# Altium schematic sheet STMKernel.SchDoc
size A3
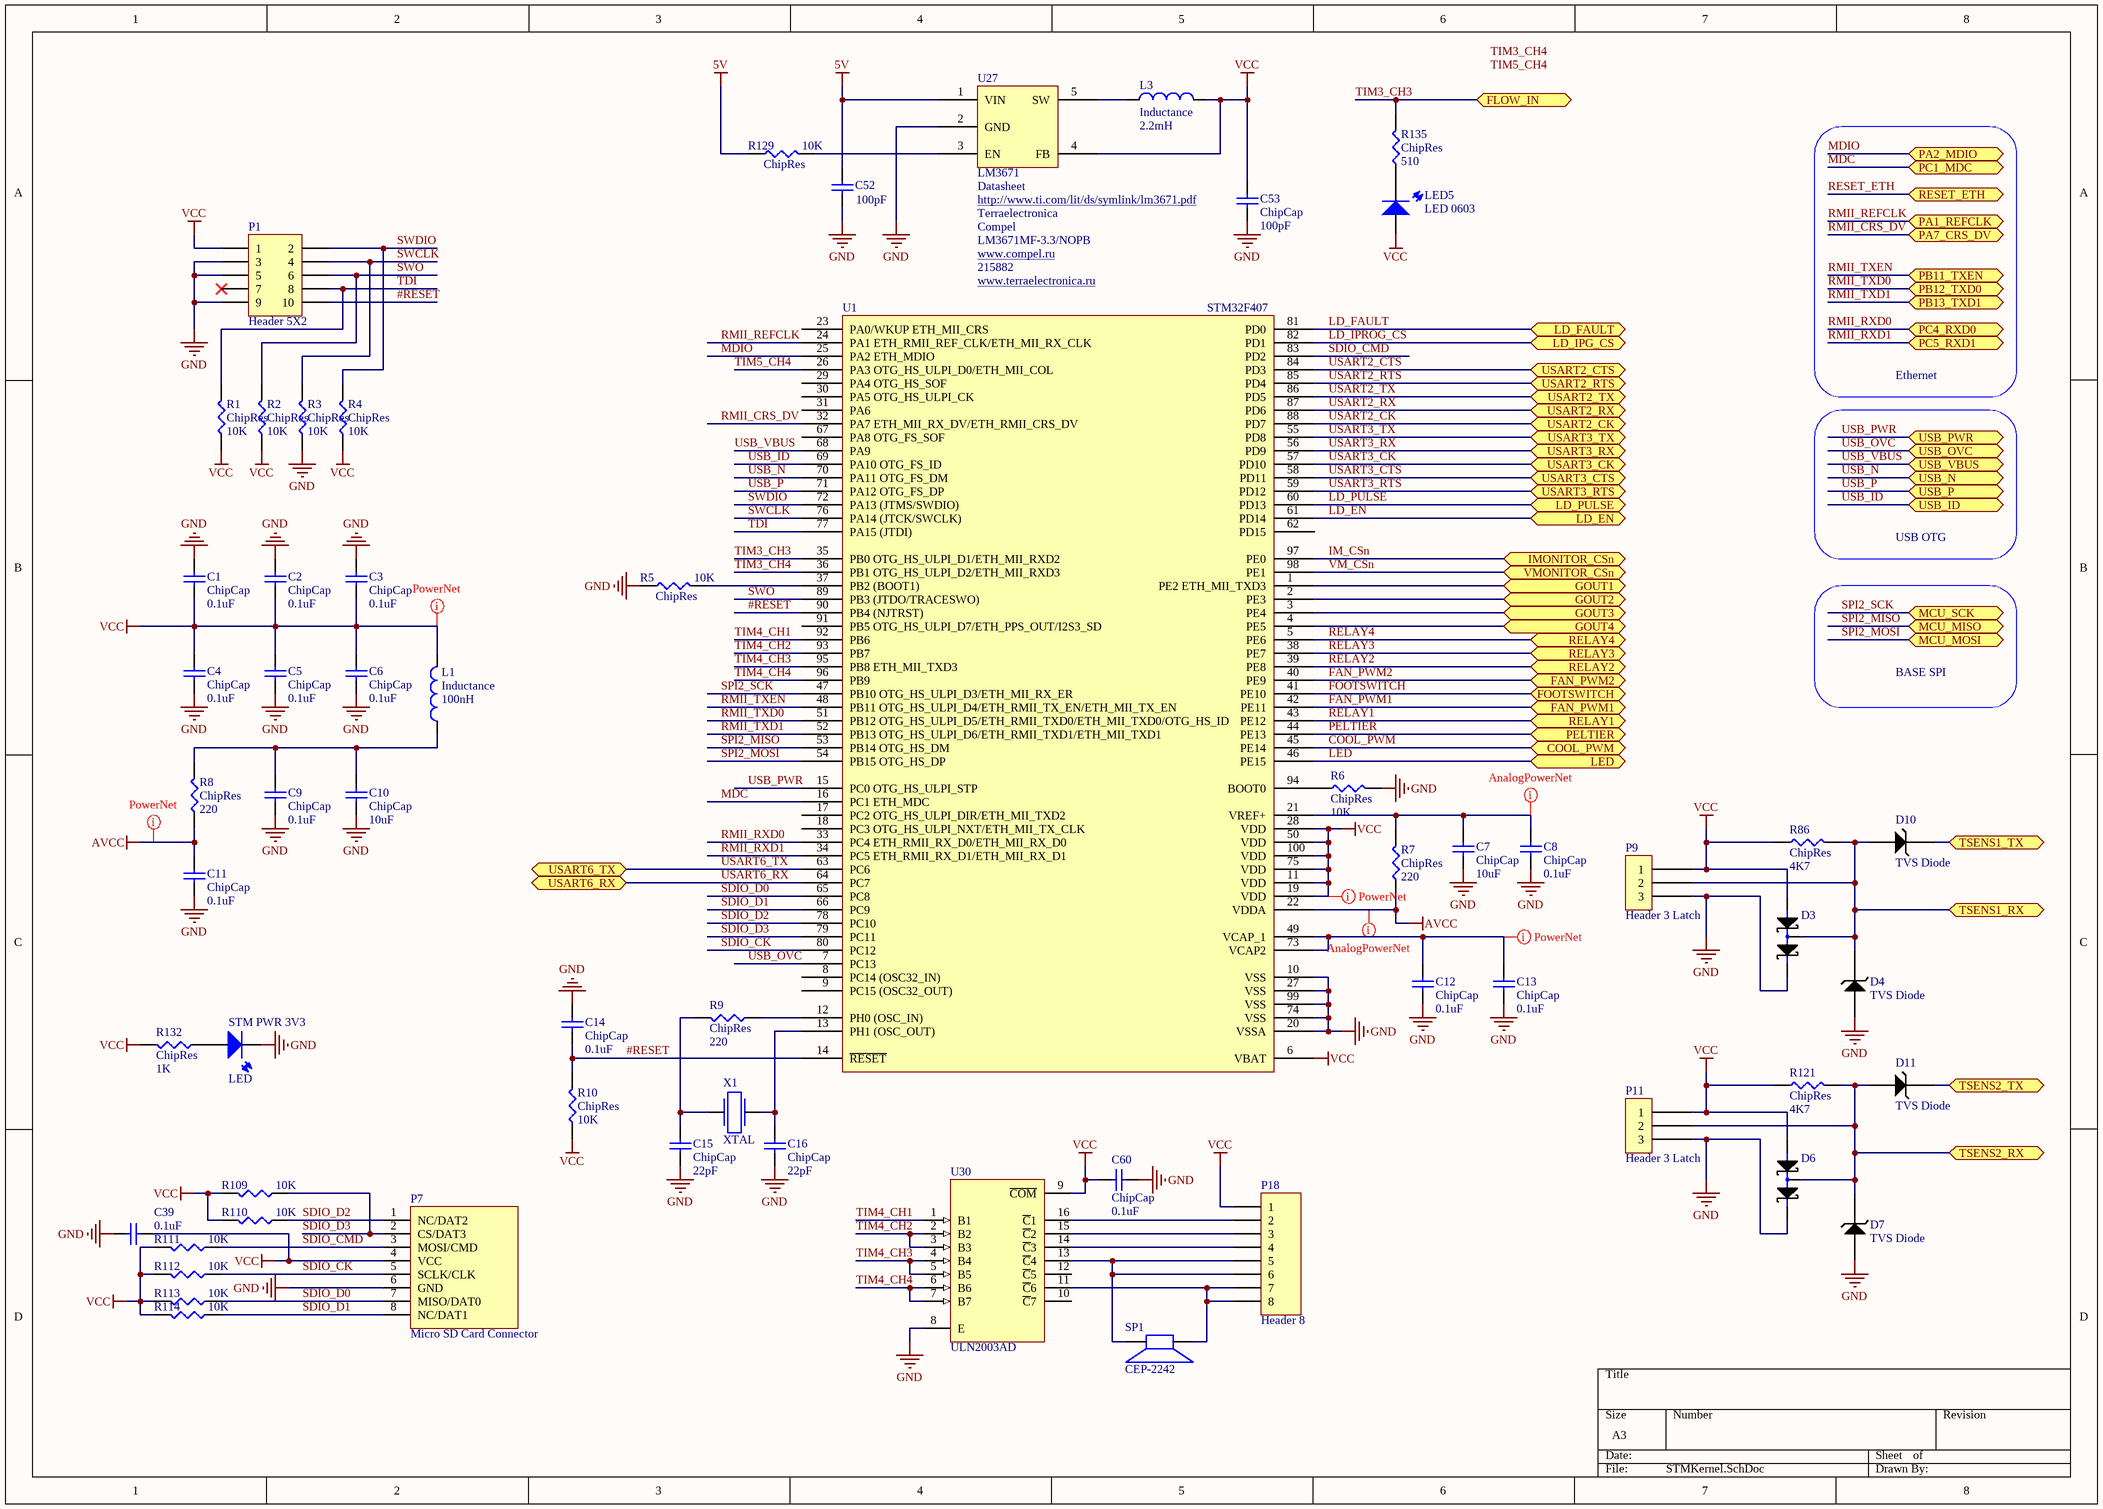
[diagram p0: STMKernel.SchDoc]

## Parts
C1  ChipCap  value 0.1uF  [CAP0805]
C2  ChipCap  value 0.1uF  [CAP0805]
C3  ChipCap  value 0.1uF  [CAP0805]
C4  ChipCap  value 0.1uF  [CAP0805]
C5  ChipCap  value 0.1uF  [CAP0805]
C6  ChipCap  value 0.1uF  [CAP0805]
C7  ChipCap  value 10uF  [CAP0805]
C8  ChipCap  value 0.1uF  [CAP0805]
C9  ChipCap  value 0.1uF  [CAP0805]
C10  ChipCap  value 10uF  [CAP0805]
C11  ChipCap  value 0.1uF  [CAP0805]
C12  ChipCap  value 0.1uF  [CAP0805]
C13  ChipCap  value 0.1uF  [CAP0805]
C14  ChipCap  value 0.1uF  [CAP0805]
C15  ChipCap  value 22pF  [CAP0805]
C16  ChipCap  value 22pF  [CAP0805]
C39  value 0.1uF  [CAP0805]  (hidden comment: ChipCap)
C52  value 100pF  [CAP1210]  (hidden comment: ChipCap)
C53  ChipCap  value 100pF  [CAP1210]
C60  ChipCap  value 0.1uF  [CAP0805]
D3  Diode Schottky  [SOT23]  (value not drawn)
D4  TVS Diode  [DO-214AS]
D6  Diode Schottky  [SOT23]  (value not drawn)
D7  TVS Diode  [DO-214AS]
D10  TVS Diode  [DO-214AS]
D11  TVS Diode  [DO-214AS]
L1  Inductance  value 100nH  [CM32]
L3  Inductance  value 2.2mH  [CDRH2D14]
LED5  LED 0603  [LED 0603]
P1  Header 5X2  [HDR2X5]
P7  Micro SD Card Connector  [WR-CRD SD Micro]
P9  Header 3 Latch  [Header 3 latch]
P11  Header 3 Latch  [Header 3 latch]
P18  Header 8  [HDR1X8]
R1  ChipRes  value 10K  [RES0805]
R2  ChipRes  value 10K  [RES0805]
R3  ChipRes  value 10K  [RES0805]
R4  ChipRes  value 10K  [RES0805]
R5  ChipRes  value 10K  [RES0805]
R6  ChipRes  value 10K  [RES0805]
R7  ChipRes  value 220  [RES0805]
R8  ChipRes  value 220  [RES0805]
R9  ChipRes  value 220  [RES0805]
R10  ChipRes  value 10K  [RES0805]
R86  ChipRes  value 4K7  [RES0805]
R109  value 10K  [RES0805]  (hidden comment: ChipRes)
R110  value 10K  [RES0805]  (hidden comment: ChipRes)
R111  value 10K  [RES0805]  (hidden comment: ChipRes)
R112  value 10K  [RES0805]  (hidden comment: ChipRes)
R113  value 10K  [RES0805]  (hidden comment: ChipRes)
R114  value 10K  [RES0805]  (hidden comment: ChipRes)
R121  ChipRes  value 4K7  [RES0805]
R129  ChipRes  value 10K  [RES0805]
R132  ChipRes  value 1K  [RES0805]
R135  ChipRes  value 510  [RES0805]
SP1  CEP-2242  [Buzzer]
STM_PWR_3V3  LED  [PLCC-2]
U1  STM32F407  [LQFP100]
U27  LM3671  ComponentLink1Description: Datasheet  Supplier 1: Terraelectronica  Supplier 2: Compel  Supplier Part Number 2: LM3671MF-3.3/NOPB  Supplier Part Number 1: 215882  [SOT23-5]
U30  ULN2003AD  [D016_N]
X1  XTAL  [BCY-W2/E4.7]

## Ports
COOL_PWM, FAN_PWM1, FAN_PWM2, FLOW_IN, FOOTSWITCH, GOUT1, GOUT2, GOUT3, GOUT4, IMONITOR_CSn, LD_EN, LD_FAULT, LD_IPG_CS, LD_PULSE, LED, MCU_MISO, MCU_MOSI, MCU_SCK, PA1_REFCLK, PA2_MDIO, PA7_CRS_DV, PB11_TXEN, PB12_TXD0, PB13_TXD1, PC1_MDC, PC4_RXD0, PC5_RXD1, PELTIER, RELAY1, RELAY2, RELAY3, RELAY4, RESET_ETH, TSENS1_RX, TSENS1_TX, TSENS2_RX, TSENS2_TX, USART2_CK, USART2_CTS, USART2_RTS, USART2_RX, USART2_TX, USART3_CK, USART3_CTS, USART3_RTS, USART3_RX, USART3_TX, USART6_RX, USART6_TX, USB_ID, USB_N, USB_OVC, USB_P, USB_PWR, USB_VBUS, VMONITOR_CSn

## Nets
5V: C52.2 R129.1 U27.1(VIN)
AVCC: C11.2 R7.1 R8.1 U1.22(VDDA)
GND: C1.2 C2.2 C3.2 C4.1 C5.1 C6.1 C7.1 C8.1 C9.1 C10.1 C11.1 C12.1 C13.1 C14.2 C15.1 C16.1 C39.2 C52.1 C53.1 C60.1 D3.2 D4.2 D6.2 D7.2 P1.3 P1.5 P1.9 P7.6(GND) P9.3 P11.3 R3.1 R5.1 R6.2 STM_PWR_3V3.1 U1.10(VSS) U1.20(VSSA) U1.27(VSS) U1.74(VSS) U1.99(VSS) U27.2(GND) U30.8(E)
VCC: C1.1 C2.1 C3.1 C4.2 C5.2 C6.2 C39.1 C53.2 C60.2 D3.1 D6.1 L1.1 L3.1 LED5.2 P1.1 P7.4(VCC) P9.1 P11.1 P18.1 R1.1 R2.1 R4.1 R10.1 R86.2 R109.2 R110.2 R111.2 R112.2 R113.2 R114.2 R121.2 R132.2 U1.6(VBAT) U1.11(VDD) U1.19(VDD) U1.28(VDD) U1.50(VDD) U1.75(VDD) U1.100(VDD) U27.4(FB) U30.9(~{COM})
#RESET: C14.1 P1.10 R10.2 U1.14(~{RESET}) U1.90(PB4_(NJTRST))
COOL_PWM: U1.45(PE14) ; port COOL_PWM
FAN_PWM1: U1.42(PE11) ; port FAN_PWM1
FAN_PWM2: U1.40(PE9) ; port FAN_PWM2
FOOTSWITCH: U1.41(PE10) ; port FOOTSWITCH
GOUT1: U1.1(PE2_ETH_MII_TXD3) ; port GOUT1
GOUT2: U1.2(PE3) ; port GOUT2
GOUT3: U1.3(PE4) ; port GOUT3
GOUT4: U1.4(PE5) ; port GOUT4
IM_CSn: U1.97(PE0) ; port IMONITOR_CSn
LD_EN: U1.61(PD14) ; port LD_EN
LD_FAULT: U1.81(PD0) ; port LD_FAULT
LD_IPROG_CS: U1.82(PD1) ; port LD_IPG_CS
LD_PULSE: U1.60(PD13) ; port LD_PULSE
LED: U1.46(PE15) ; port LED
MDC: U1.16(PC1_ETH_MDC) ; port PC1_MDC
MDIO: U1.25(PA2_ETH_MDIO) ; port PA2_MDIO
PELTIER: U1.44(PE13) ; port PELTIER
RELAY1: U1.43(PE12) ; port RELAY1
RELAY2: U1.39(PE8) ; port RELAY2
RELAY3: U1.38(PE7) ; port RELAY3
RELAY4: U1.5(PE6) ; port RELAY4
RESET_ETH: port RESET_ETH
RMII_CRS_DV: U1.32(PA7_ETH_MII_RX_DV/ETH_RMII_CRS_DV) ; port PA7_CRS_DV
RMII_REFCLK: U1.24(PA1_ETH_RMII_REF_CLK/ETH_MII_RX_CLK) ; port PA1_REFCLK
RMII_RXD0: U1.33(PC4_ETH_RMII_RX_D0/ETH_MII_RX_D0) ; port PC4_RXD0
RMII_RXD1: U1.34(PC5_ETH_RMII_RX_D1/ETH_MII_RX_D1) ; port PC5_RXD1
RMII_TXD0: U1.51(PB12_OTG_HS_ULPI_D5/ETH_RMII_TXD0/ETH_MII_TXD0/OTG_HS_ID) ; port PB12_TXD0
RMII_TXD1: U1.52(PB13_OTG_HS_ULPI_D6/ETH_RMII_TXD1/ETH_MII_TXD1) ; port PB13_TXD1
RMII_TXEN: U1.48(PB11_OTG_HS_ULPI_D4/ETH_RMII_TX_EN/ETH_MII_TX_EN) ; port PB11_TXEN
SDIO_CK: P7.5(SCLK/CLK) R112.1 U1.80(PC12)
SDIO_CMD: P7.3(MOSI/CMD) R111.1 U1.83(PD2)
SDIO_D0: P7.7(MISO/DAT0) R113.1 U1.65(PC8)
SDIO_D1: P7.8(NC/DAT1) R114.1 U1.66(PC9)
SDIO_D2: P7.1(NC/DAT2) R110.1 U1.78(PC10)
SDIO_D3: P7.2(CS/DAT3) R109.1 U1.79(PC11)
SPI2_MISO: U1.53(PB14_OTG_HS_DM) ; port MCU_MISO
SPI2_MOSI: U1.54(PB15_OTG_HS_DP) ; port MCU_MOSI
SPI2_SCK: U1.47(PB10_OTG_HS_ULPI_D3/ETH_MII_RX_ER) ; port MCU_SCK
SWCLK: P1.4 R3.2 U1.76(PA14_(JTCK/SWCLK))
SWDIO: P1.2 R4.2 U1.72(PA13_(JTMS/SWDIO))
SWO: P1.6 R2.2 U1.89(PB3_(JTDO/TRACESWO))
TDI: P1.8 R1.2 U1.77(PA15_(JTDI))
TIM3_CH3: R135.2 U1.35(PB0_OTG_HS_ULPI_D1/ETH_MII_RXD2) ; port FLOW_IN
TIM3_CH4: U1.36(PB1_OTG_HS_ULPI_D2/ETH_MII_RXD3)
TIM4_CH1: U1.92(PB6) U30.1(B1)
TIM4_CH2: U1.93(PB7) U30.2(B2) U30.3(B3)
TIM4_CH3: U1.95(PB8_ETH_MII_TXD3) U30.4(B4) U30.5(B5)
TIM4_CH4: U1.96(PB9) U30.6(B6) U30.7(B7)
TIM5_CH4: U1.26(PA3_OTG_HS_ULPI_D0/ETH_MII_COL)
TSENS1_RX: D3.3 D4.1 D10.2 P9.2 R86.1 ; port TSENS1_RX
TSENS1_TX: D10.1 ; port TSENS1_TX
TSENS2_RX: D6.3 D7.1 D11.2 P11.2 R121.1 ; port TSENS2_RX
TSENS2_TX: D11.1 ; port TSENS2_TX
USART2_CK: U1.88(PD7) ; port USART2_CK
USART2_CTS: U1.84(PD3) ; port USART2_CTS
USART2_RTS: U1.85(PD4) ; port USART2_RTS
USART2_RX: U1.87(PD6) ; port USART2_RX
USART2_TX: U1.86(PD5) ; port USART2_TX
USART3_CK: U1.57(PD10) ; port USART3_CK
USART3_CTS: U1.58(PD11) ; port USART3_CTS
USART3_RTS: U1.59(PD12) ; port USART3_RTS
USART3_RX: U1.56(PD9) ; port USART3_RX
USART3_TX: U1.55(PD8) ; port USART3_TX
USART6_RX: U1.64(PC7) ; port USART6_RX
USART6_TX: U1.63(PC6) ; port USART6_TX
USB_ID: U1.69(PA10_OTG_FS_ID) ; port USB_ID
USB_N: U1.70(PA11_OTG_FS_DM) ; port USB_N
USB_OVC: U1.7(PC13) ; port USB_OVC
USB_P: U1.71(PA12_OTG_FS_DP) ; port USB_P
USB_PWR: U1.15(PC0_OTG_HS_ULPI_STP) ; port USB_PWR
USB_VBUS: U1.68(PA9) ; port USB_VBUS
VM_CSn: U1.98(PE1) ; port VMONITOR_CSn
NetC7_2: C7.2 C8.2 R7.2 U1.21(VREF+)
NetC9_2: C9.2 C10.2 L1.2 R8.2
NetC12_2: C12.2 C13.2 U1.49(VCAP_1) U1.73(VCAP2)
NetC15_2: C15.2 R9.2 X1.1
NetC16_2: C16.2 U1.13(PH1_(OSC_OUT)) X1.2
NetL3_2: L3.2 U27.5(SW)
NetLED5_1: LED5.1 R135.1
NetP18_2: P18.2 U30.16(~{C}1)
NetP18_3: P18.3 U30.15(~{C}2)
NetP18_4: P18.4 U30.14(~{C}3)
NetP18_5: P18.5 P18.6 SP1.2 U30.13(~{C}4)
NetP18_7: P18.7 P18.8 SP1.1 U30.11(~{C}6)
NetR5_2: R5.2 U1.37(PB2_(BOOT1))
NetR6_1: R6.1 U1.94(BOOT0)
NetR9_1: R9.1 U1.12(PH0_(OSC_IN))
NetR129_2: R129.2 U27.3(EN)
NetR132_1: R132.1 STM_PWR_3V3.2

Not connected (* = marked no-connect by the designer): P1 7*; U1 8(PC14_(OSC32_IN)) 9(PC15_(OSC32_OUT)) 17(PC2_OTG_HS_ULPI_DIR/ETH_MII_TXD2) 18(PC3_OTG_HS_ULPI_NXT/ETH_MII_TX_CLK) 23(PA0/WKUP_ETH_MII_CRS) 29(PA4_OTG_HS_SOF) 30(PA5_OTG_HS_ULPI_CK) 31(PA6) 62(PD15) 67(PA8_OTG_FS_SOF) 91(PB5_OTG_HS_ULPI_D7/ETH_PPS_OUT/I2S3_SD); U30 10(~{C}7) 12(~{C}5)

## Layout directives
net class PowerNet: NetC12_2
net class Undefined: AVCC, VCC
net class AnalogPowerNet: AVCC, NetC7_2

## Notes on the sheet
- Ethernet
- USB OTG
- BASE SPI
- Labels drawn without touching a wire or pin: TIM3_CH4, TIM5_CH4

## Library data of the parts
C1-C16 C39 C52 C53 C60 = ChipCap: Capacitor; Published: 8-Jun-2000; LatestRevisionDate: 17-Jul-2002; LatestRevisionNote: Re-released for DXP Platform.; PackageReference: RAD-0.3; Publisher: Altium Limited
D3 D6 = Schottky Diode: 2-Diode Schottky
D4 D7 D10 D11 = TVS Diode SMA
L1 L3 = ChipInductance
LED5 STM_PWR_3V3 = LED0603
P1 = Header 5X2: Header, 5-Pin, Dual row; LatestRevisionDate: 17-Jul-2002; LatestRevisionNote: Re-released for DXP Platform.; Publisher: Altium Limited
P7 = MicroSDHeader8
P9 P11 = Header 3 latch: Header 3 with latch
P18 = Header 8: Header, 8-Pin; LatestRevisionDate: 17-Jul-2002; LatestRevisionNote: Re-released for DXP Platform.; Publisher: Altium Limited
R1-R10 R86 R109-R114 R121 R129 R132 R135 = ChipRes: Chip resistor
SP1 = Buzzer CEP-2242: Buzzer
U1 = STM32F407VGT6: ST Microcontroller ARM 32-bit Cortex M4
U27 = LM3671MF: 600-mA Step-Down DC-DC Converter; ComponentLink1URL: http://www.ti.com/lit/ds/symlink/lm3671.pdf; Supplier URL 2: www.compel.ru; Supplier URL 1: www.terraelectronica.ru
U30 = ULN2003AD: Darlington Transistor Array; Published: 15-May-2002; LatestRevisionDate: 13-Apr-2006; LatestRevisionNote: IPC-7351 Footprint Added.; DatasheetVersion: Sep-1986; PackageVersion: Jan-1998; PackageReference: D016; Publisher: Altium Limited; PackageDescription: 16-Pin Small Outline Integrated Circuit 1.27 mm Pitch; Code_IPC: SOIC127P600-16; ComponentLink1Description: Manufacturer Link; ComponentLink1URL: http://www.ti.com/; ComponentLink2Description: Datasheet; ComponentLink2URL: http://www-s.ti.com/sc/ds/uln2002a.pdf
X1 = Crystall oscillator: Quartz crystall oscillator